# EAGLE schematic with_solar_universal (EAGLE 9.4.2)
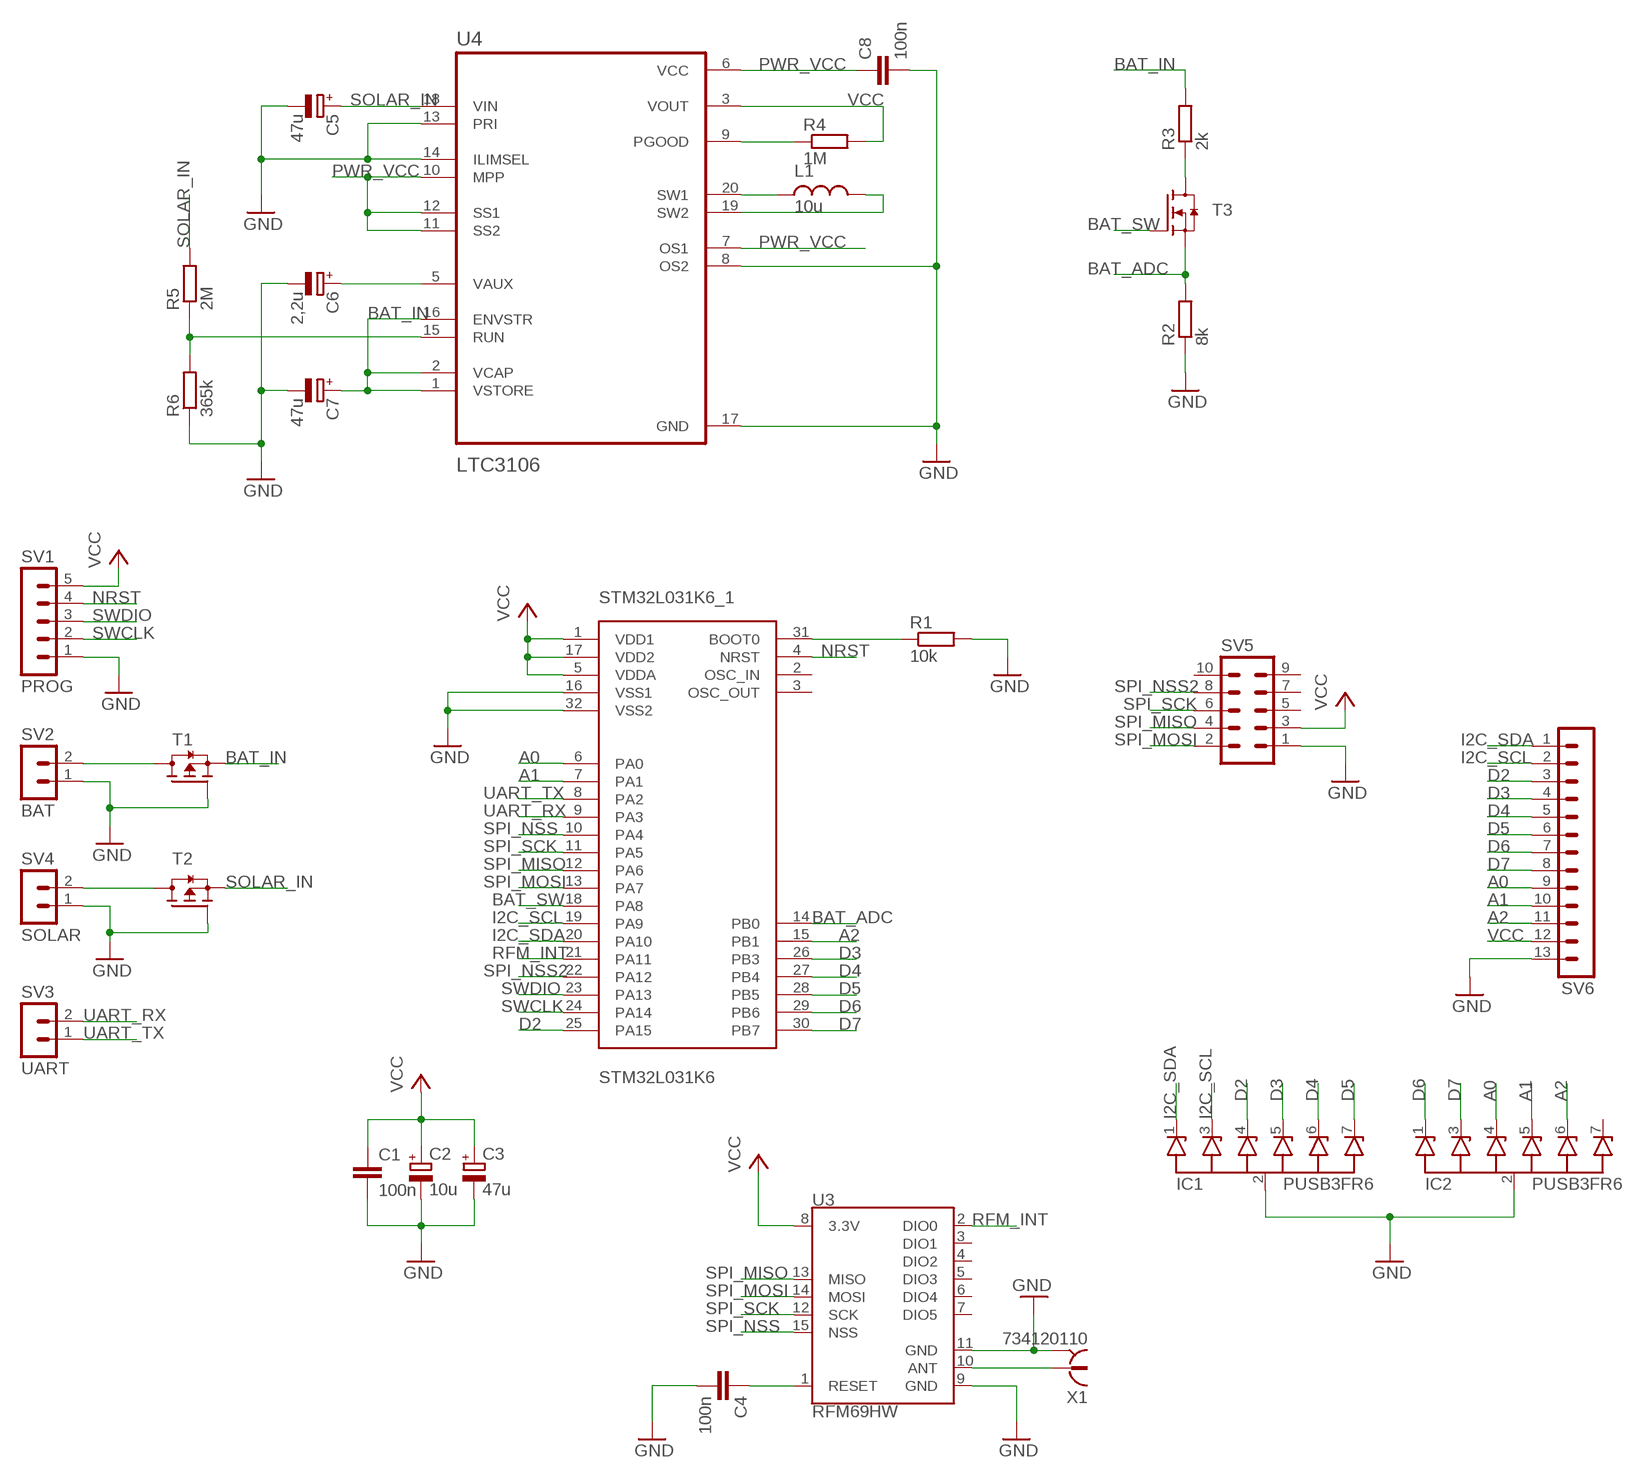
[diagram p0: schematic, sheet 1]

## Parts
C1  100n  C-EUC1206  [C1206]
C2  10u  CPOL-EUUD-4X5,8  [UD-4X5,8_NICHICON]
C3  47u  CPOL-EUUD-4X5,8  [UD-4X5,8_NICHICON]
C4  100n  C-EUC1206  [C1206]
C5  47u  CPOL-EUUD-4X5,8  [UD-4X5,8_NICHICON]
C6  2,2u  CPOL-EUUD-4X5,8  [UD-4X5,8_NICHICON]
C7  47u  CPOL-EUUD-4X5,8  [UD-4X5,8_NICHICON]
C8  100n  C-EUC1206  [C1206]
IC1  PUSB3FR6  [DFN2111-7]
IC2  PUSB3FR6  [DFN2111-7]
L1  10u  L1210  [R1210]
R1  10k  R-EU_R0805  [R0805]
R2  8k  R-EU_R0805  [R0805]
R3  2k  R-EU_R0805  [R0805]
R4  1M  R-EU_R0805  [R0805]
R5  2M  R-EU_R0805  [R0805]
R6  365k  R-EU_R0805  [R0805]
STM32L031K6_1  STM32L031K6  [LQFP32-7X7]
SV1  PROG  MA05-1  [MA05-1]
SV2  BAT  MA02-1  [MA02-1]
SV3  UART  MA02-1  [MA02-1]
SV4  SOLAR  MA02-1  [MA02-1]
SV5  MA05-2  [MA05-2]
SV6  MA13-1  [MA13-1]
T1  RTQ035P02HZG  [SOT457R_PHILIPS]
T2  RTQ035P02HZG  [SOT457R_PHILIPS]
T3  RQ6E050AJTCR  [SOT457R_PHILIPS]
U3  RFM69HW  [RFM69W-XXXS2]
U4  LTC3106  [LTC3106]
X1  734120110  [734120110]

## Nets
A0: IC2.4 STM32L031K6_1.6(PA0) SV6.9
A1: IC2.5 STM32L031K6_1.7(PA1) SV6.10
A2: IC2.6 STM32L031K6_1.15(PB1) SV6.11
BAT_ADC: R2.2 STM32L031K6_1.14(PB0) T3.4(S)
BAT_IN: C7.+ R3.2 T1.4(S) U4.1(VSTORE) U4.2(VCAP) U4.16(ENVSTR)
BAT_SW: STM32L031K6_1.18(PA8) T3.3(G)
D2: IC1.4 STM32L031K6_1.25(PA15) SV6.3
D3: IC1.5 STM32L031K6_1.26(PB3) SV6.4
D4: IC1.6 STM32L031K6_1.27(PB4) SV6.5
D5: IC1.7 STM32L031K6_1.28(PB5) SV6.6
D6: IC2.1 STM32L031K6_1.29(PB6) SV6.7
D7: IC2.3 STM32L031K6_1.30(PB7) SV6.8
GND: C1.2 C2.- C3.- C4.2 C5.- C6.- C7.- C8.2 IC1.2 IC2.2 R1.2 R2.1 R6.1 STM32L031K6_1.16(VSS1) STM32L031K6_1.32(VSS2) SV1.1 SV2.1 SV4.1 SV5.1 SV6.13 T1.3(G) T2.3(G) U3.9(GND) U3.11(GND) U4.8(OS2) U4.13(PRI) U4.14(ILIMSEL) U4.17(GND) X1.S@1 X1.S@2 X1.S@3
I2C_SCL: IC1.3 STM32L031K6_1.19(PA9) SV6.2
I2C_SDA: IC1.1 STM32L031K6_1.20(PA10) SV6.1
N$1: R1.1 STM32L031K6_1.31(BOOT0)
N$2: U3.10(ANT) X1.1
N$3: L1.1 U4.20(SW1)
N$4: L1.2 U4.19(SW2)
N$5: C6.+ U4.5(VAUX)
N$6: R4.1 U4.9(PGOOD)
N$7: R5.1 R6.2 U4.15(RUN)
N$10: C4.1 U3.1(RESET)
N$19: R3.1 T3.1(D) T3.2(D) T3.5(D) T3.6(D)
NRST: STM32L031K6_1.4(NRST) SV1.4
PWR_VCC: C8.1 U4.6(VCC) U4.7(OS1) U4.10(MPP) U4.11(SS2) U4.12(SS1)
RFM_INT: STM32L031K6_1.21(PA11) U3.2(DIO0)
SOLAR_IN: C5.+ R5.2 T2.4(S) U4.18(VIN)
SPI_MISO: STM32L031K6_1.12(PA6) SV5.4 U3.13(MISO)
SPI_MOSI: STM32L031K6_1.13(PA7) SV5.2 U3.14(MOSI)
SPI_NSS: STM32L031K6_1.10(PA4) U3.15(NSS)
SPI_NSS2: STM32L031K6_1.22(PA12) SV5.8
SPI_SCK: STM32L031K6_1.11(PA5) SV5.6 U3.12(SCK)
SWCLK: STM32L031K6_1.24(PA14) SV1.2
SWDIO: STM32L031K6_1.23(PA13) SV1.3
T1: SV2.2 T1.1(D) T1.2(D) T1.5(D) T1.6(D)
T2: SV4.2 T2.1(D) T2.2(D) T2.5(D) T2.6(D)
UART_RX: STM32L031K6_1.9(PA3) SV3.2
UART_TX: STM32L031K6_1.8(PA2) SV3.1
VCC: C1.1 C2.+ C3.+ R4.2 STM32L031K6_1.1(VDD1) STM32L031K6_1.5(VDDA) STM32L031K6_1.17(VDD2) SV1.5 SV5.3 SV6.12 U3.8(3.3V) U4.3(VOUT)
Unconnected: IC2.7 STM32L031K6_1.2(OSC_IN) STM32L031K6_1.3(OSC_OUT) SV5.5 SV5.7 SV5.9 SV5.10 U3.3(DIO1) U3.4(DIO2) U3.5(DIO3) U3.6(DIO4) U3.7(DIO5)

## Library data of the parts
C1 C4 C8 = rcl:C-EU: CAPACITOR, European symbol; SPICEPREFIX: C
C2 C3 C5-C7 = rcl:CPOL-EU: POLARIZED CAPACITOR, European symbol; SPICEPREFIX: C
IC1 IC2 = esd:PUSB3FR6
L1 = dp:L1210
R1-R6 = rcl:R-EU_: RESISTOR, European symbol; SPICEPREFIX: R
STM32L031K6_1 = dp:STM32L031K6
SV1 = con-lstb:MA05-1: PIN HEADER; OC_FARNELL: unknown; OC_NEWARK: unknown
SV2-SV4 = dp:MA02-1
SV5 = con-lstb:MA05-2: PIN HEADER; OC_FARNELL: unknown; OC_NEWARK: unknown
SV6 = con-lstb:MA13-1: PIN HEADER; OC_FARNELL: unknown; OC_NEWARK: unknown
T1 T2 = dp:RTQ035P02HZG
T3 = dp:RQ6E050AJTCR
U3 = SparkFun-RF:RFM69H: Hope RF RFM69H ISM Transceiver Module The RFM69H is a transceiver module capable of operation over a wide frequency range, including the 315,433,868 and 915MHz license-free ISM (Industry Scientific and Medical) frequency bands. All major RF communication parameters are programmable and most of them can be dynamically set. The RFM69H offers the unique advantage of programmable narrow-band and wide- band communication modes. The RFM69H is optimized for low power consumption while offering high RF output power and channelized operation.Compliance ETSI and FCC regulations. Datasheet <http://www.hoperf.cn/upload/docs/RF/SX/RFM69H_DataSheet_v1.3.pdf> SparkFun Products RFM69HCW Wireless Transceiver - 915MHz <https://www.sparkfun.com/products/13909> (COM-13909) RFM69HCW Wireless Transceiver - 434MHz <https://www.sparkfun.com/products/13910> (COM-13910) SparkFun RFM69 Breakout (915MHz) <https://www.sparkfun.com/products/12775> (WRL-12775) SparkFun RFM69 Breakout (434MHz) <https://www.sparkfun.com/products/12823> (WRL-12823)
U4 = LTC3106:LTC3106
X1 = con-coax:734120110: MICRO COAXIAL CONNECTOR RECEPTACLE VERTICAL Source: Data sheet <http://www.molex.com/pdm_docs/sd/734120110_sd.pdf>